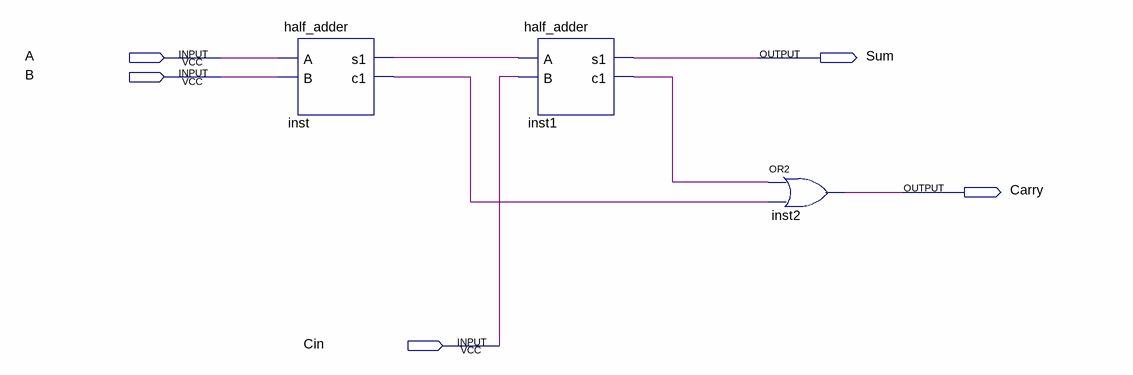
[diagram p0: schematic sheet]
// Quartus schematic full_adder.bdf as structural Verilog: 3 symbols, 5 pins
module full_adder (
  input  A,
  input  B,
  input  Cin,
  output Sum,
  output Carry
);

  wire inst1_c1, inst_c1, inst_s1;

  half_adder inst (.A(A), .B(B), .s1(inst_s1), .c1(inst_c1));
  half_adder inst1 (.A(inst_s1), .B(Cin), .s1(Sum), .c1(inst1_c1));
  or inst2 (Carry, inst1_c1, inst_c1);
endmodule
